# Altium schematic sheet LCD_WIRELESS.SchDoc
size A4
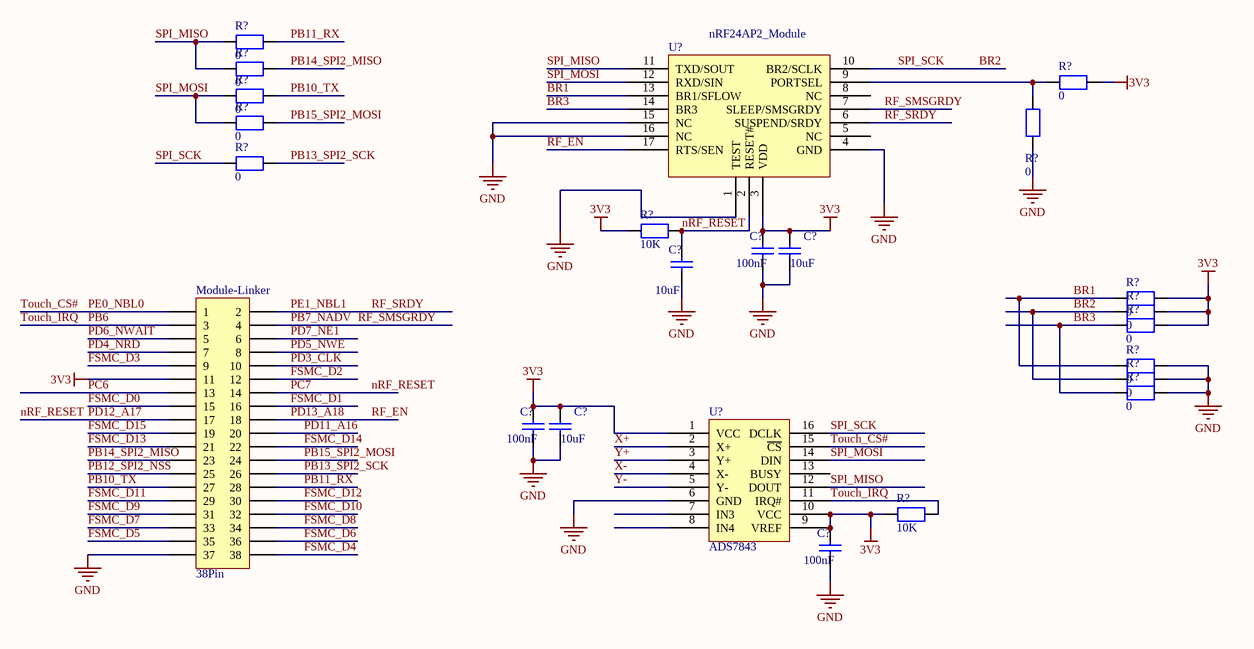
[diagram p0: LCD_WIRELESS.SchDoc]

## Parts
(Parts that share a designator on the sheet are numbered #1, #2 ... from top to bottom, then left to right.)
C?#1  100nF
C?#2  10uF
C?#3  10uF
C?#4  100nF
C?#5  10uF
C?#6  100nF
Module-Linker  38Pin  [HDR2X19]
R?#1  0
R?#2  0
R?#3  0
R?#4  0
R?#5  0
R?#6  0
R?#7  0
R?#8  10K
R?#9  0
R?#10  0
R?#11  0
R?#12  0
R?#13  0
R?#14  0
R?#15  10K
U?#1  nRF24AP2_Module
U?#2  ADS7843

## Nets
3V3: C?#1.1 C?#2.1 C?#4.1 C?#5.1 C?#6.1 Module-Linker.11 R?#3.1 R?#9.1 R?#10.1 R?#11.1 U?#1.3(VDD) U?#2.1(VCC) U?#2.9(VREF) U?#2.10(VCC)
GND: Module-Linker.37 R?#12.1 R?#13.1 R?#14.1 U?#1.1(TEST) U?#1.4(GND) U?#1.15(NC) U?#1.16(NC) U?#2.6(GND)
BR1: U?#1.13(BR1/SFLOW)
BR2: U?#1.10(BR2/SCLK) U?#2.16(DCLK)  [also labelled SPI_SCK]
BR3: U?#1.14(BR3)
FSMC_D0: Module-Linker.15
FSMC_D1: Module-Linker.16
FSMC_D2: Module-Linker.12
FSMC_D3: Module-Linker.9
FSMC_D4: Module-Linker.38
FSMC_D5: Module-Linker.35
FSMC_D6: Module-Linker.36
FSMC_D7: Module-Linker.33
FSMC_D8: Module-Linker.34
FSMC_D9: Module-Linker.31
FSMC_D10: Module-Linker.32
FSMC_D11: Module-Linker.29
FSMC_D12: Module-Linker.30
FSMC_D13: Module-Linker.21
FSMC_D14: Module-Linker.22
FSMC_D15: Module-Linker.19
nRF_RESET: C?#3.1 Module-Linker.14 Module-Linker.17 R?#8.1 U?#1.2(RESET#)  [also labelled PC7, PD12_A17]
PB6: Module-Linker.3 R?#15.1 U?#2.11(IRQ#)  [also labelled Touch_IRQ]
PB7_NADV: Module-Linker.4 U?#1.7(SLEEP/SMSGRDY)  [also labelled RF_SMSGRDY]
PB10_TX: Module-Linker.27 R?#4.1
PB11_RX: Module-Linker.28 R?#1.1
PB12_SPI2_NSS: Module-Linker.25
PB13_SPI2_SCK: Module-Linker.26 R?#6.1
PB14_SPI2_MISO: Module-Linker.23 R?#2.1
PB15_SPI2_MOSI: Module-Linker.24 R?#5.1
PC6: Module-Linker.13
PD3_CLK: Module-Linker.10
PD4_NRD: Module-Linker.7
PD5_NWE: Module-Linker.8
PD6_NWAIT: Module-Linker.5
PD7_NE1: Module-Linker.6
PD11_A16: Module-Linker.20
PD13_A18: Module-Linker.18 U?#1.17(RTS/SEN)  [also labelled RF_EN]
PE0_NBL0: Module-Linker.1 U?#2.15(~{CS})  [also labelled Touch_CS#]
PE1_NBL1: Module-Linker.2 U?#1.6(SUSPEND/SRDY)  [also labelled RF_SRDY]
SPI_MISO: U?#1.11(TXD/SOUT) U?#2.12(DOUT)
SPI_MOSI: U?#1.12(RXD/SIN) U?#2.14(DIN)
X+: U?#2.2(X+)
X-: U?#2.4(X-)
Y+: U?#2.3(Y+)
Y-: U?#2.5(Y-)
NetR?#7_1: R?#7.1 U?#1.9(PORTSEL)

Not connected (* = marked no-connect by the designer): C?#1 2; C?#2 2; C?#3 2; C?#4 2; C?#5 2; C?#6 2; R?#1 2; R?#2 2; R?#3 2; R?#4 2; R?#5 2; R?#6 2; R?#7 2; R?#8 2; R?#9 2; R?#10 2; R?#11 2; R?#12 2; R?#13 2; R?#14 2; R?#15 2; U?#1 5(NC) 8(NC); U?#2 7(IN3) 8(IN4) 13(BUSY)

## Library data of the parts
C?#1-C?#6 = CAP
Module-Linker = Header 19X2: Header, 19-Pin, Dual row; LatestRevisionDate: 17-Jul-2002; LatestRevisionNote: Re-released for DXP Platform.; Publisher: Altium Limited
R?#1-R?#15 = RES
U?#2 = ADS7843: 触摸芯片